# EasyEDA Pro project Battery Tree V2.eprj

# Schematic Schematic1
Create Date: 2024-08-14; Page Name: P1; Project Name: Battery Tree V2; Schematic Name: Schematic1; Update Date: 2024-08-14; Company: EasyEDA.com; Drawn: EasyEDA; Page Size: A4; Part Number: JLCPCB-002; Reviewed: EasyEDA; Version: V0.1
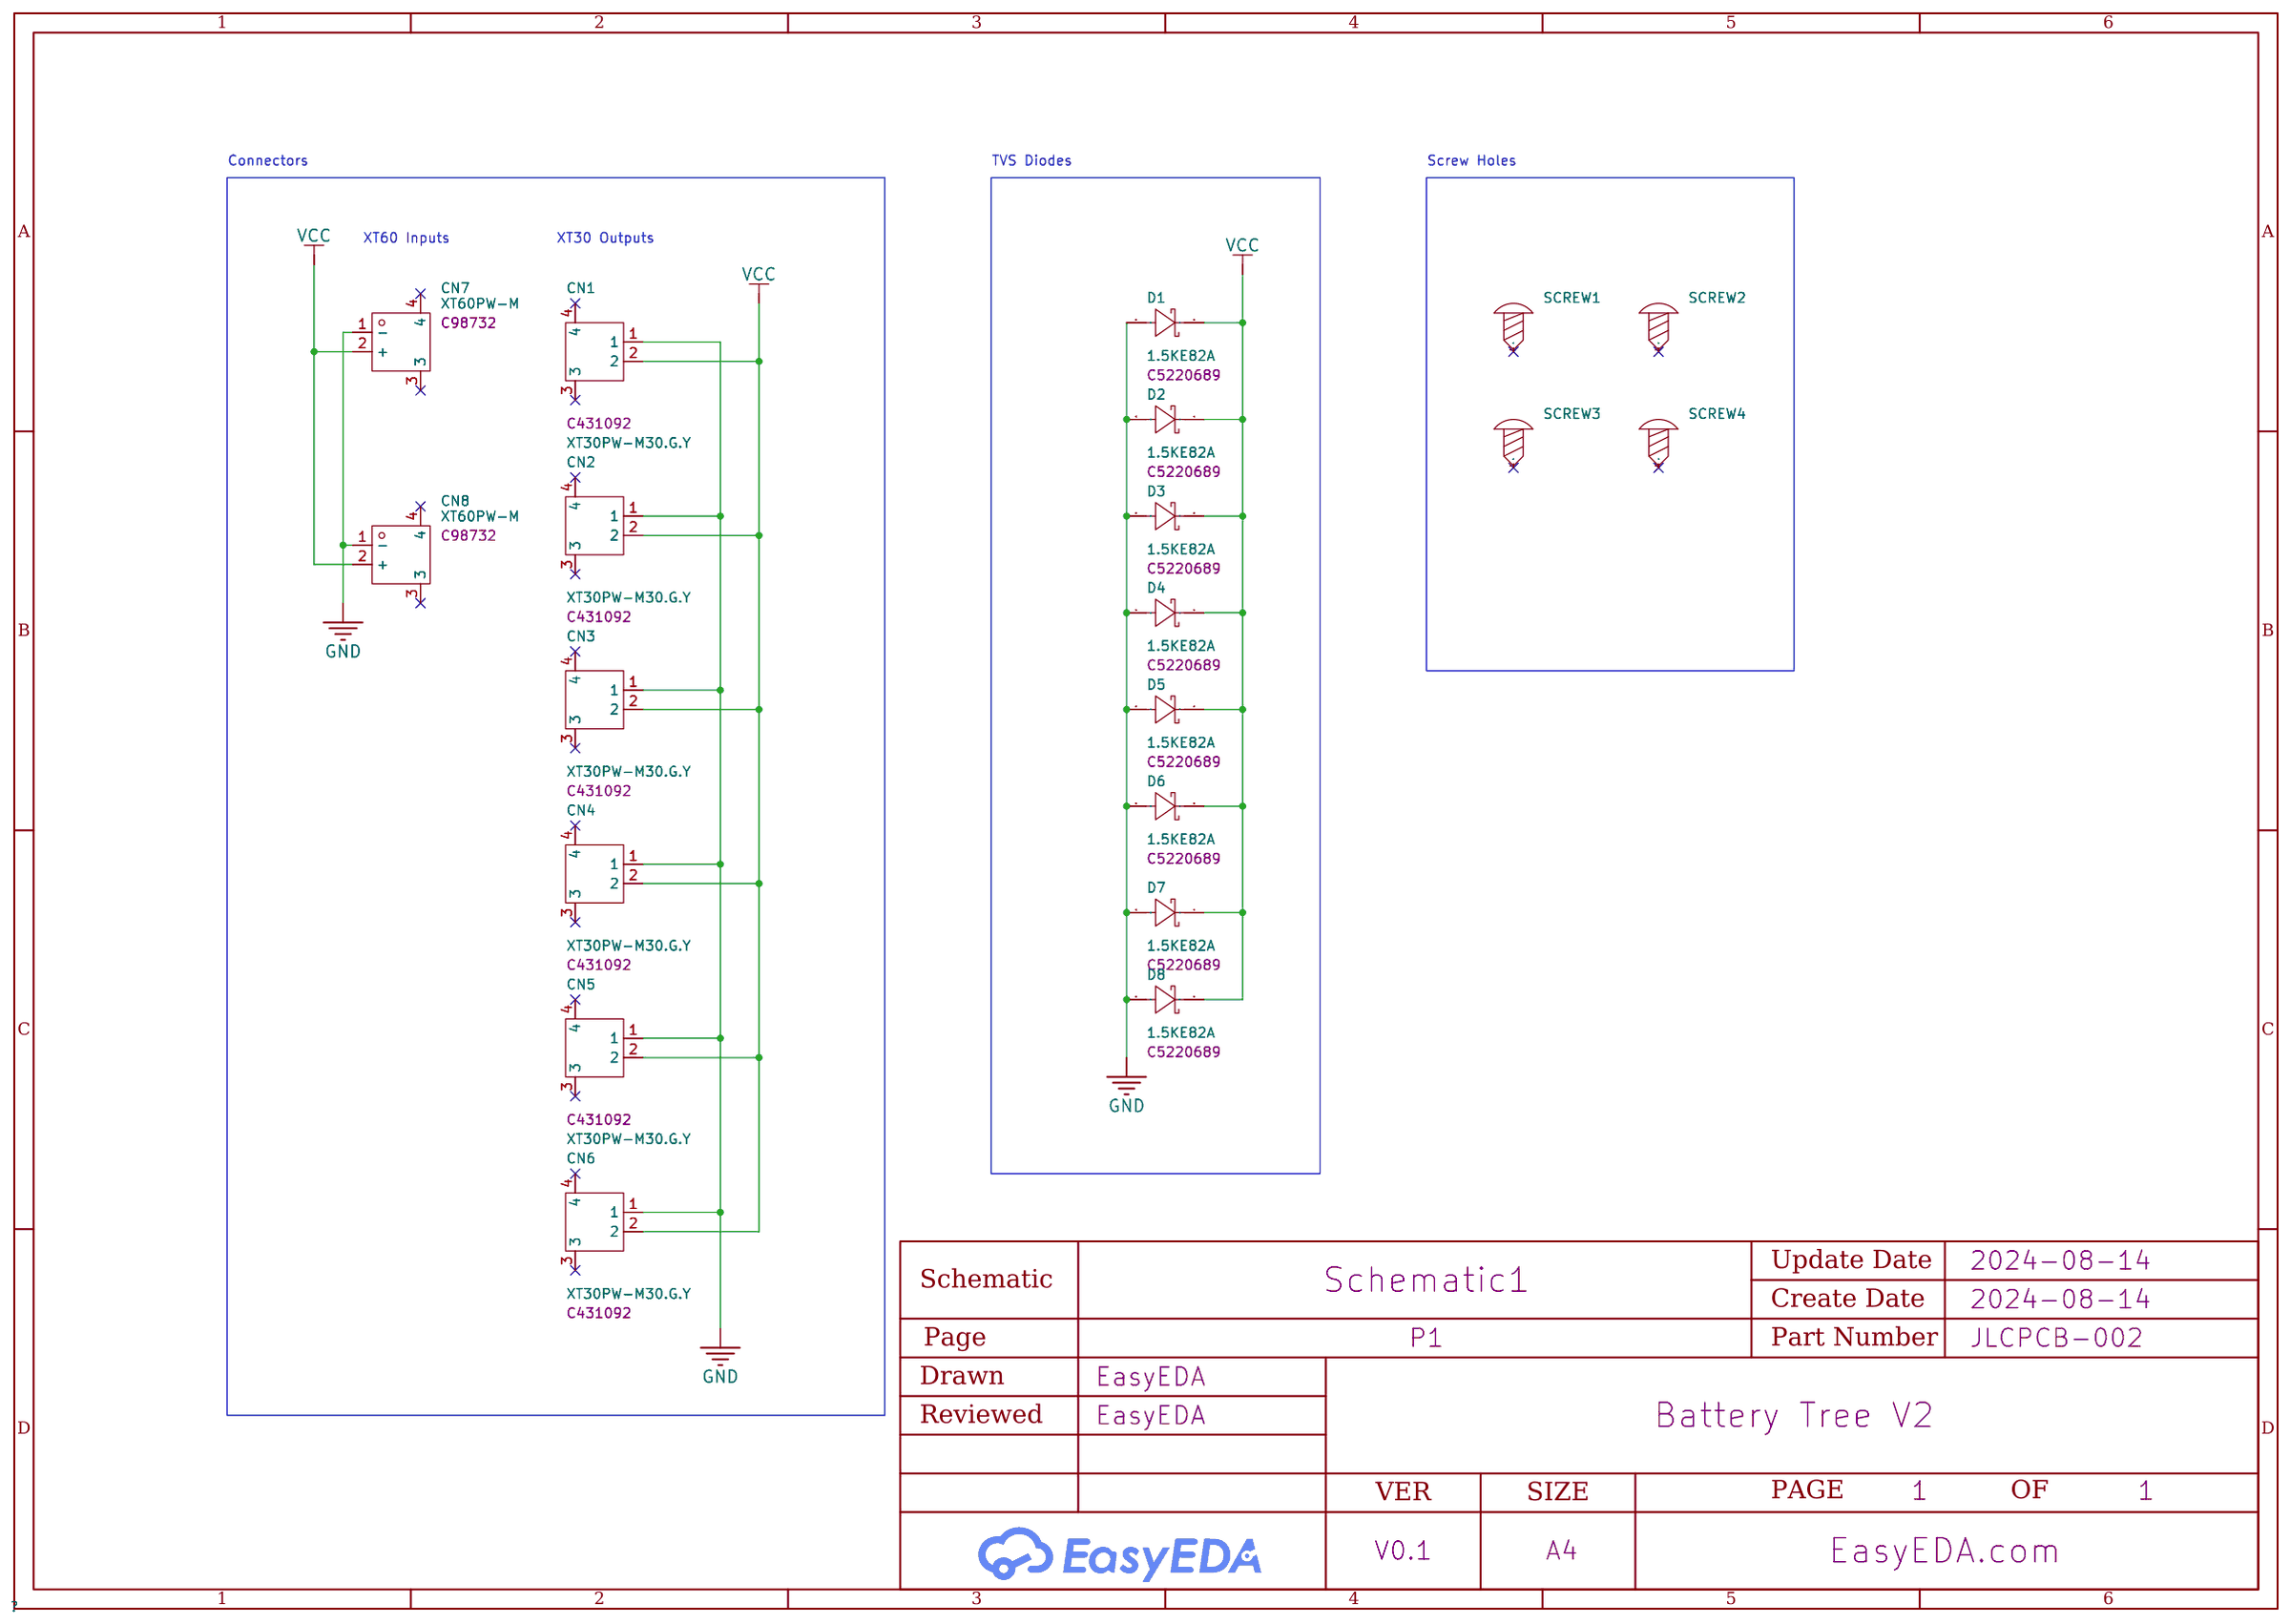
[diagram p0: schematic sheet]

## Parts
CN1  XT30PW-M30.G.Y  [CONN-TH_XT30PW-M]
CN2  XT30PW-M30.G.Y  [CONN-TH_XT30PW-M]
CN3  XT30PW-M30.G.Y  [CONN-TH_XT30PW-M]
CN4  XT30PW-M30.G.Y  [CONN-TH_XT30PW-M]
CN5  XT30PW-M30.G.Y  [CONN-TH_XT30PW-M]
CN6  XT30PW-M30.G.Y  [CONN-TH_XT30PW-M]
CN7  XT60PW-M  [CONN-TH_XT60PW-M]
CN8  XT60PW-M  [CONN-TH_XT60PW-M]
D1  1.5KE82A  [DIO-TH_BD5.1-L8.4-P12.40-D1.0-RD]
D2  1.5KE82A  [DIO-TH_BD5.1-L8.4-P12.40-D1.0-RD]
D3  1.5KE82A  [DIO-TH_BD5.1-L8.4-P12.40-D1.0-RD]
D4  1.5KE82A  [DIO-TH_BD5.1-L8.4-P12.40-D1.0-RD]
D5  1.5KE82A  [DIO-TH_BD5.1-L8.4-P12.40-D1.0-RD]
D6  1.5KE82A  [DIO-TH_BD5.1-L8.4-P12.40-D1.0-RD]
D7  1.5KE82A  [DIO-TH_BD5.1-L8.4-P12.40-D1.0-RD]
D8  1.5KE82A  [DIO-TH_BD5.1-L8.4-P12.40-D1.0-RD]
SCREW1  -  [Screw-Hole-M3]  (no BOM)
SCREW2  -  [Screw-Hole-M3]  (no BOM)
SCREW3  -  [Screw-Hole-M3]  (no BOM)
SCREW4  -  [Screw-Hole-M3]  (no BOM)

## Library data of the parts
CN1-CN6 = XT30PW-M30.G.Y: Power:- Output:- Input:- Size:- Interface:- Type:- Colour:- MaximumCurrent:- Type:Aviation model plug RatedVoltage:DC 500V Type1:- NumberOfUSBHoles:- InterfaceType:Male head MetalMaterial:- InsulationMaterial:- RatedCurrent:15A RecommendedWireGauge:16/18/; LCSC Part Name: AMASS(艾迈斯)航模插头 卧式弯脚 XT30PW-M公头; Supplier Part: C431092; Manufacturer: AMASS(艾迈斯); JLCPCB Part Class: Extended Part; Datasheet: https://atta.szlcsc.com/upload/public/pdf/source/20220222/6A9F22F7850E25B33E1BE430ADF8560B.pdf; Supplier: LCSC; Type: Aviation model plug; RatedVoltage: DC 500V; InterfaceType: Male head; RatedCurrent: 15A; RecommendedWireGauge: 16/18/20AWG; contact resistance: 1.2mΩ; specifications: 2pin; Check: true
CN7 CN8 = XT60PW-M: Brand:艾迈斯 Model:XT60PW-M Power:- Output:- Input:- Size:- Interface:- Type:- Colour:Yellow MaximumCurrent:- Type:卧式插头 RatedVoltage:- Type1:- NumberOfUSBHoles:- InterfaceType:公头 MetalMaterial:- InsulationMaterial:- RatedCurrent:- RecommendedWireGauge:- Flam; LCSC Part Name: AMASS(艾迈斯)航模插头xt60连接器150公母对接pw锂电池公头 板插卧式XT60PW-M; Supplier Part: C98732; Manufacturer: AMASS(艾迈斯); JLCPCB Part Class: Extended Part; Datasheet: https://atta.szlcsc.com/upload/public/pdf/source/20240118/44A3DCFF53BE25DC65378AFFB21277A4.pdf; Supplier: LCSC; Brand: 艾迈斯; Type: 卧式插头; Colour: Yellow; InterfaceType: 公头; Check: true
D1-D8 = 1.5KE82AHE3_A/D: Reverse Stand-Off Voltage (Vrwm):70.1V Maximum Clamping Voltage:113V Peak Pulse Current (Ipp)@10/1000us:13.3A Peak Pulse Power Dissipation (Ppp)@10/1000us:1.5kW Breakdown Voltage:77.9V Type:TVS; Supplier Part: C5220689; Manufacturer: Shenzhen Jinkaisheng Elec; Supplier Footprint: DO-201AA(DO-27); JLCPCB Part Class: Extended Part; Datasheet: https://atta.szlcsc.com/upload/public/pdf/source/20210429/F15769E08F8AD9C0D8DF15E8B979D164.pdf; Supplier: LCSC; Reverse Stand-Off Voltage (Vrwm): 70.1V; Maximum Clamping Voltage: 113V; Peak Pulse Current (Ipp)@10/1000us: 13.3A; Peak Pulse Power Dissipation (Ppp)@10/1000us: 1.5kW; Breakdown Voltage: 77.9V; Type: TVS; Check: true
SCREW1-SCREW4 = Screw-Hole-M3: Supplier Footprint: 插件

## Nets
GND: CN1.1 CN2.1 CN3.1 CN4.1 CN5.1 CN6.1 CN7.1(-) CN8.1(-) D1.2(K) D2.2(K) D3.2(K) D4.2(K) D5.2(K) D6.2(K) D7.2(K) D8.2(K)
VCC: CN1.2 CN2.2 CN3.2 CN4.2 CN5.2 CN6.2 CN7.2(+) CN8.2(+) D1.1(A) D2.1(A) D3.1(A) D4.1(A) D5.1(A) D6.1(A) D7.1(A) D8.1(A)

Not connected (* = marked no-connect by the designer): CN1 3* 4*; CN2 3* 4*; CN3 3* 4*; CN4 3* 4*; CN5 3* 4*; CN6 3* 4*; CN7 3* 4*; CN8 3* 4*; SCREW1 1*; SCREW2 1*; SCREW3 1*; SCREW4 1*

## Notes on the sheet
- Connectors
- TVS Diodes
- Screw Holes
- XT60 Inputs
- XT30 Outputs

# Board PCB1
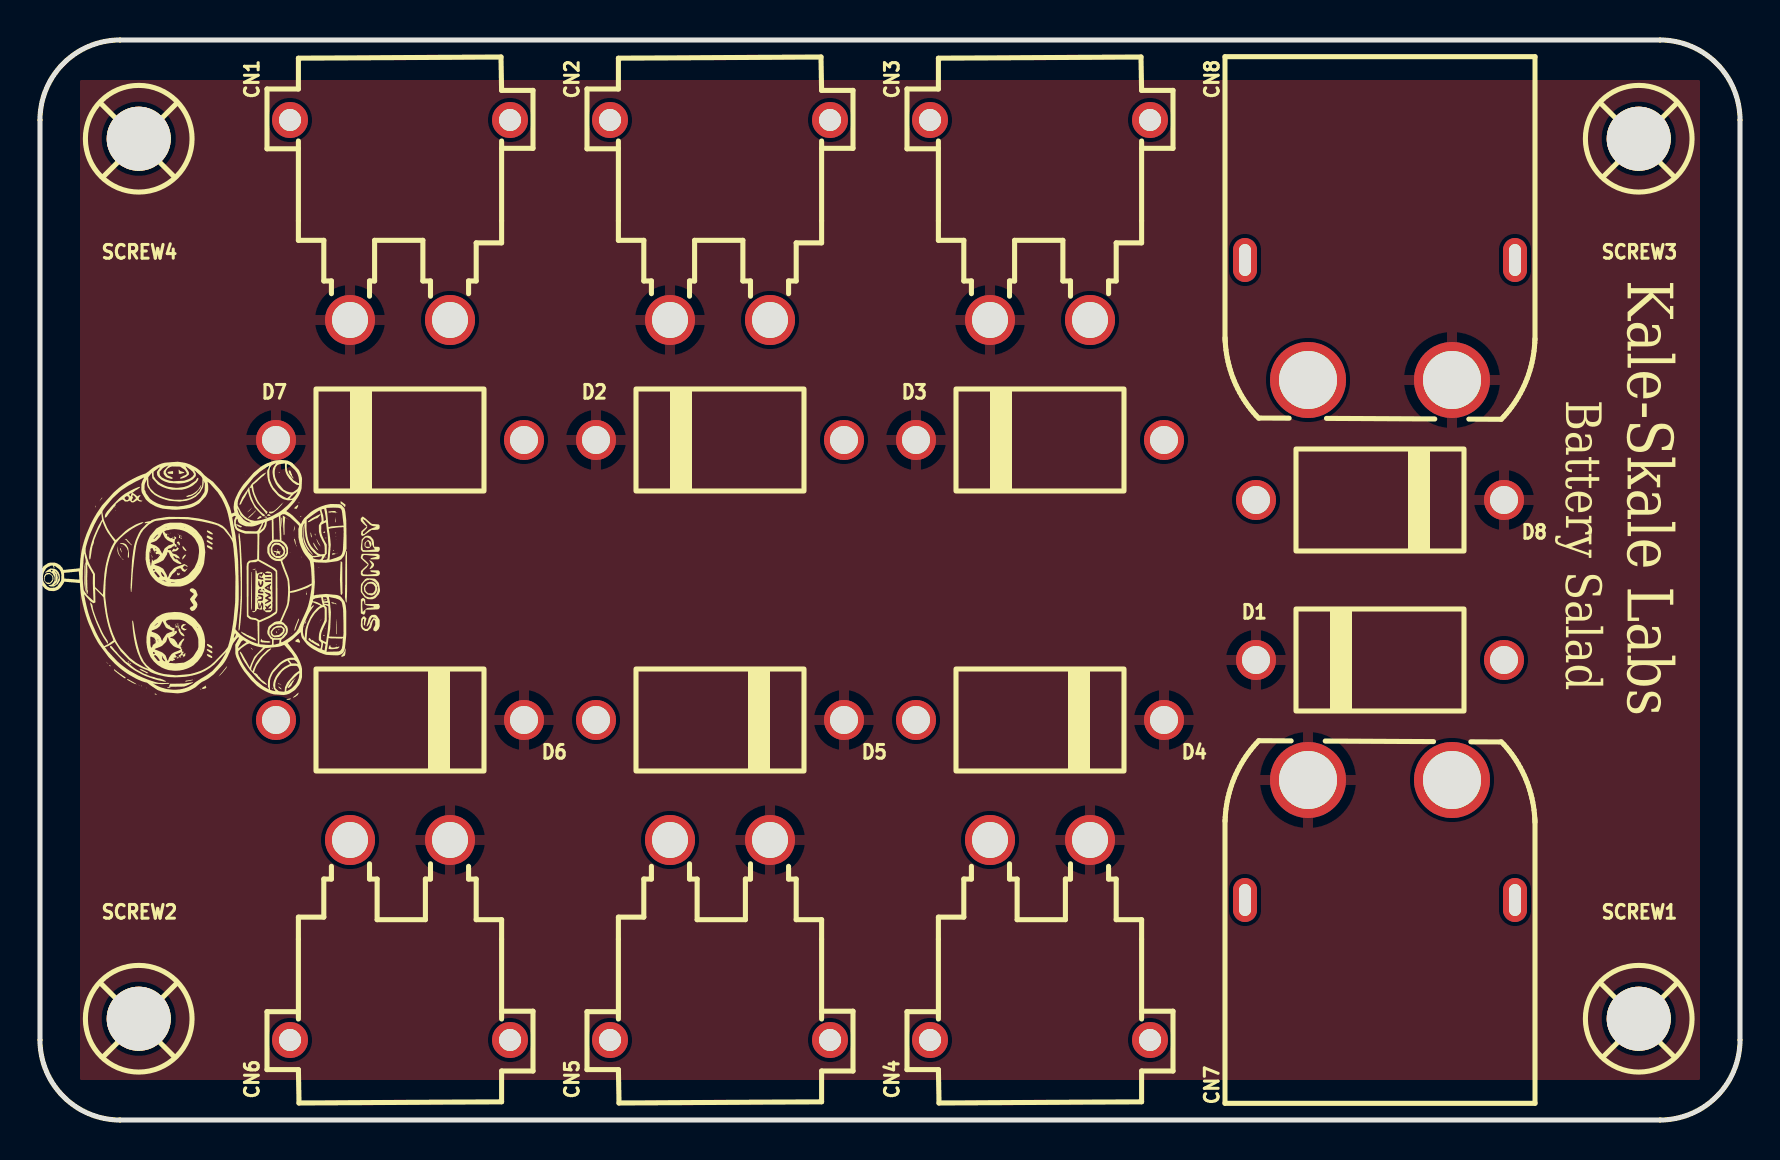
[diagram p1: board, top side]
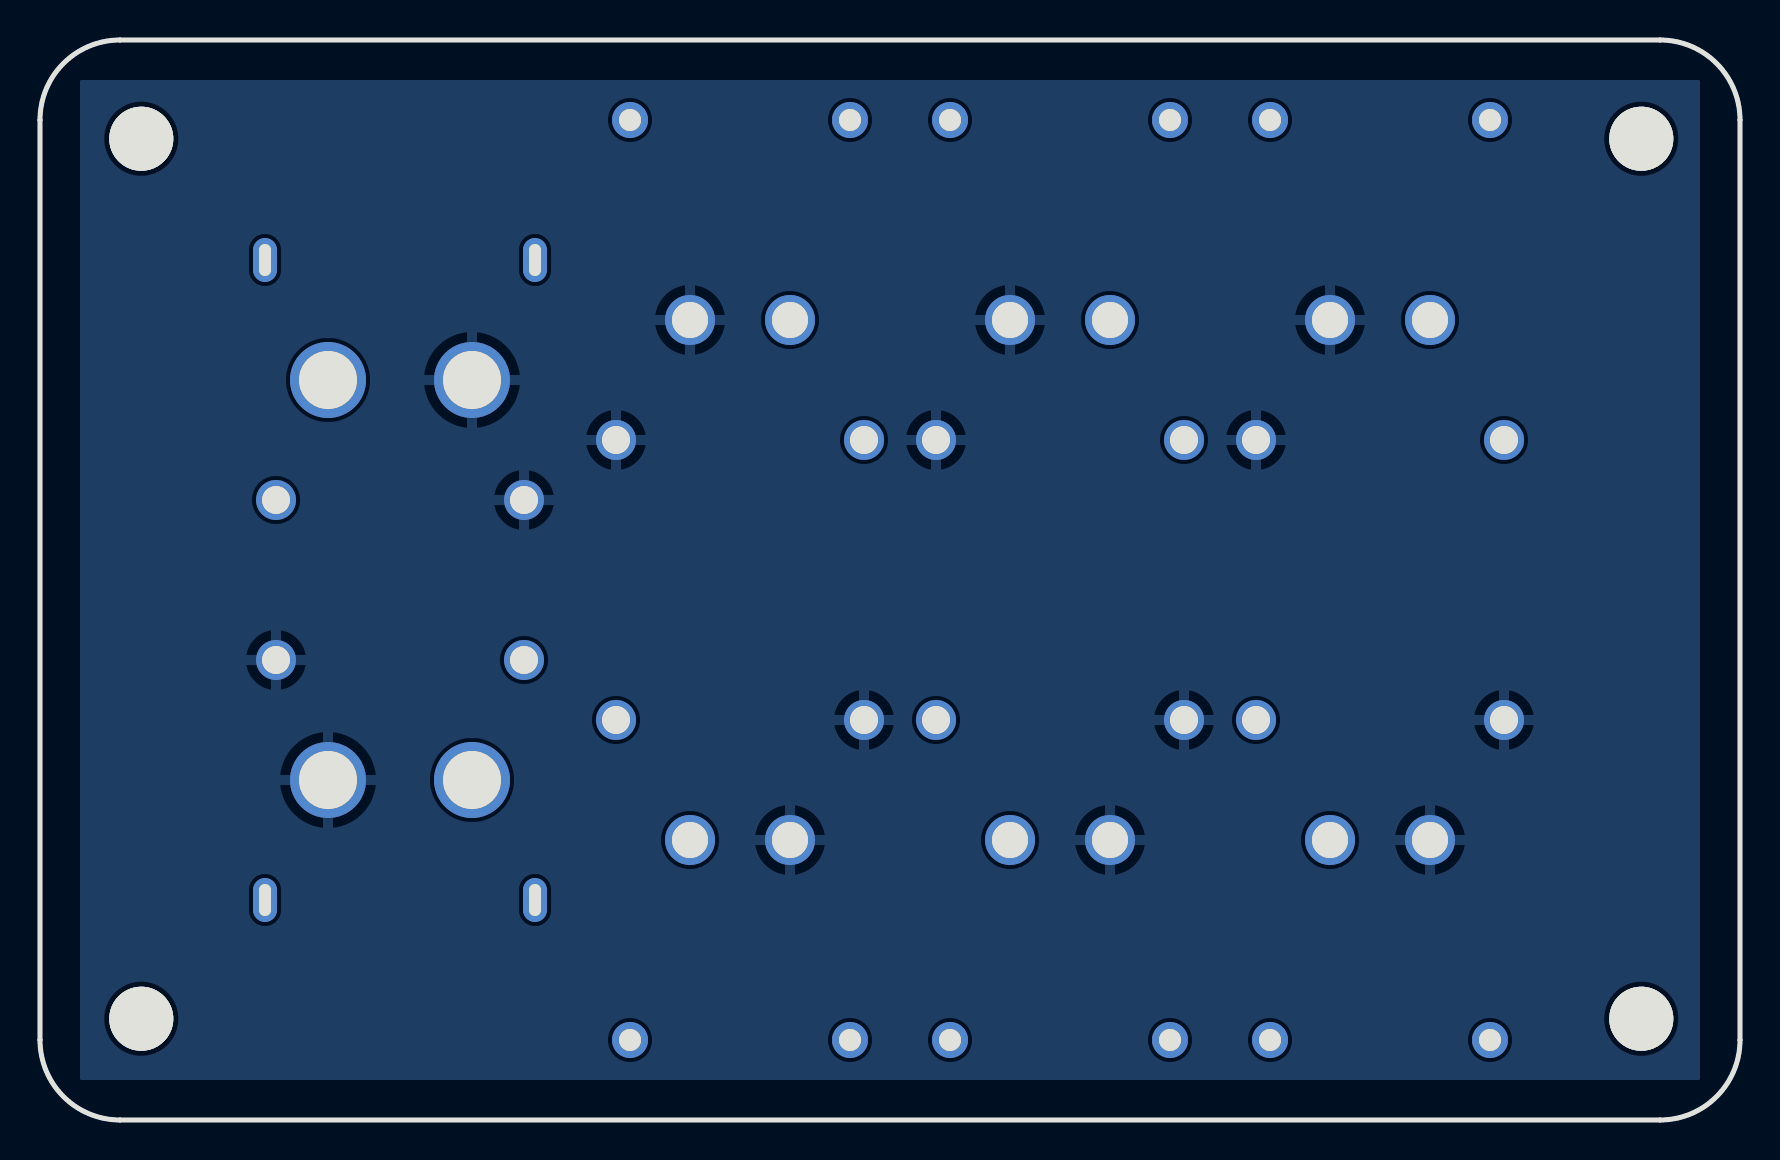
[diagram p2: board, bottom side, seen from below]

Outline 85 x 54 mm; copper layers: Top Layer, Bottom Layer. Coordinates in mm from the lower left corner of the outline.
Outline path: 0,50 0,4 arc(1.17,1.17) 4,0 81,0 arc(83.83,1.17) 85,4 85,50 arc(83.83,52.83) 81,54 4,54 arc(1.17,52.83) 0,50
Stack: Top Layer 0.035mm / Dielectric1 1.51mm FR4 er 4.5 / Bottom Layer 0.035mm

## Design rules (mm)
template: Custom Config
spacing copperThickness1oz (default): track to track 0.102, other pairs 0.152 to 0.3
spacing copperThickness2oz: track to track 0.203, other pairs 0.152 to 0.3
track width copperThickness1oz (default): min 0.127, default 0.254, max 2.54
track width copperThickness2oz: min 0.203, default 0.254, max 2.54
differential pair differentialPair (default): width min 0.127, default 0.254, max 2.54; gap min 0.152, default 0.152
via viaSize (default): diameter min 0.5, default 0.61, max 10; hole min 0.3, default 0.305, max 6.3

## Placement (name value [footprint] x y rotation side)
CN1  XT30PW-M30.G.Y  [CONN-TH_XT30PW-M]  18 45 180 top
CN2  XT30PW-M30.G.Y  [CONN-TH_XT30PW-M]  34 45 180 top
CN3  XT30PW-M30.G.Y  [CONN-TH_XT30PW-M]  50 45 180 top
CN4  XT30PW-M30.G.Y  [CONN-TH_XT30PW-M]  50 9 0 top
CN5  XT30PW-M30.G.Y  [CONN-TH_XT30PW-M]  34 9 0 top
CN6  XT30PW-M30.G.Y  [CONN-TH_XT30PW-M]  18 9 0 top
CN7  XT60PW-M  [CONN-TH_XT60PW-M]  67 14 90 top
CN8  XT60PW-M  [CONN-TH_XT60PW-M]  67 40 270 top
D1  1.5KE82A  [DIO-TH_BD5.1-L8.4-P12.40-D1.0-RD]  67 23 0 top
D2  1.5KE82A  [DIO-TH_BD5.1-L8.4-P12.40-D1.0-RD]  34 34 0 top
D3  1.5KE82A  [DIO-TH_BD5.1-L8.4-P12.40-D1.0-RD]  50 34 0 top
D4  1.5KE82A  [DIO-TH_BD5.1-L8.4-P12.40-D1.0-RD]  50 20 180 top
D5  1.5KE82A  [DIO-TH_BD5.1-L8.4-P12.40-D1.0-RD]  34 20 180 top
D6  1.5KE82A  [DIO-TH_BD5.1-L8.4-P12.40-D1.0-RD]  18 20 180 top
D7  1.5KE82A  [DIO-TH_BD5.1-L8.4-P12.40-D1.0-RD]  18 34 0 top
D8  1.5KE82A  [DIO-TH_BD5.1-L8.4-P12.40-D1.0-RD]  67 31 180 top
SCREW1  -  [Screw-Hole-M3]  80 5 0 top
SCREW2  -  [Screw-Hole-M3]  5 5 0 top
SCREW3  -  [Screw-Hole-M3]  80 49 0 top
SCREW4  -  [Screw-Hole-M3]  5 49 0 top

## Footprints (pads in the part's own frame, mm; a bottom-side part is the same pattern mirrored in y, then rotated)
CONN-TH_XT30PW-M
  round 2.5 hole 1.8: 1(-2.5,5) 2(2.5,5)
  round 1.8 hole 1.1: 3(5.5,-5) 4(-5.5,-5)
CONN-TH_XT60PW-M
  round 3.8 hole 2.9: 1(3,-3.6) 2(3,3.6)
  oval 2.2x1.2 hole 1.6x0.6: 3(-3,6.75) 4(-3,-6.75)
DIO-TH_BD5.1-L8.4-P12.40-D1.0-RD
  round 2 hole 1.4: 1(-6.2,0) 2(6.2,0)
Screw-Hole-M3
  round 3.2 hole 3.2: 1(-0.064,0.064)

## Nets
As in the schematic.

Pads without a net: CN1 3 4; CN2 3 4; CN3 3 4; CN4 3 4; CN5 3 4; CN6 3 4; CN7 3 4; CN8 3 4; SCREW1 1; SCREW2 1; SCREW3 1; SCREW4 1

## Copper pours and planes (outline as drawn; the poured copper is in the pictures)
GND on Bottom Layer: 2,52 83,52 83,2 2,2
VCC on Top Layer: 2,52 83,52 83,2 2,2

## Text on the board
Top Silkscreen Layer: Battery Salad | Kale-Skale Labs
